# Altium project ProtoWatch.PrjPcb (part 2 of 2)

## Sheet LiPo_Charger.SchDoc: LiPo Charger
size 431 x 279 mm; VersionControl_RevNumber: 1.0; VersionControl_ProjFolderRevNumber: 1.0.0; ApprovedBy: ESE; CheckedBy: Justin, Bhagath; Author: Justin, bhagath; CompanyName: ESE Dept; DrawnBy: Justin, Bhagath; Engineer: Justin, Bhagath; Organization: ORGANIZATION; Address1: Electrical Engineering; Address2: 200 S 33rd St; Address3: Philadelphia; Address4: Pa 19104; DocumentNumber: 5; Revision: -; SheetNumber: 5; SheetTotal: 7; Project: ProtoWatch; ENG_APP_DATE: 02/12/21; DSN_APP_DATE: 02/12/21; CHK_APP_DATE: 02/12/21
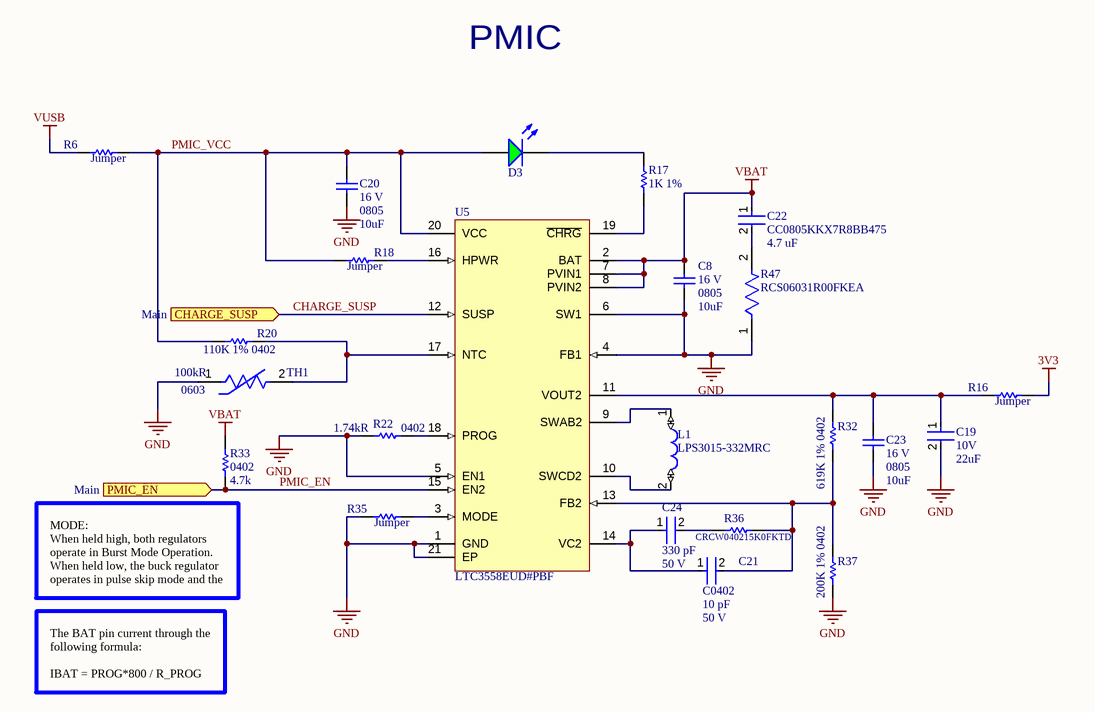
[diagram p4: LiPo_Charger.SchDoc]

### Parts
C8  value 10uF  Rated Voltage: 16 V  Case-EIA: 0805  [CAPC0805(2012)145_N]  (hidden comment: CAP 10uF 16V 0805(2012))
C19  Voltage Rating: 10V  Capacitance: 22uF  [FP-LMK107B-A-MFG]  (hidden comment: LMK107BBJ226MA-T)
C20  value 10uF  Rated Voltage: 16 V  Case-EIA: 0805  [CAPC0805(2012)145_N]  (hidden comment: CAP 10uF 16V 0805(2012))
C21  value 10 pF  Package: C0402  Voltage Rating: 50 V  [FP-C0402-BB-MFG]  (hidden comment: C0402C100D5GAC)
C22  CC0805KKX7R8BB475  Capacitance: 4.7 uF  [FP-CC0805-0_85-MFG]
C23  value 10uF  Rated Voltage: 16 V  Case-EIA: 0805  [CAPC0805(2012)145_N]  (hidden comment: CAP 10uF 16V 0805(2012))
C24  value 330 pF  Voltage Rating: 50 V  [FP-CC0402-MFG]  (hidden comment: CC0402KRX7R9BB331)
D3  LTST-C170GKT  [LTST-C170GKT_V]  (value not drawn)
L1  LPS3015-332MRC  [LPS3015]
R6  Jumper  [RESC0603(1608)_N]
R16  Jumper  [RESC0603(1608)_N]
R17  1K 1%  [RESC0603(1608)_N]
R18  Jumper  [RESC0603(1608)_N]
R20  110K 1% 0402  [RESC0402(1005)_M]
R22  Case/Package: 0402  Resistance: 1.74kR  [RESC1005X40X25LL05T05]  (hidden comment: CRCW04021K74FKED)
R32  619K 1% 0402  [RESC0402(1005)_L]
R33  Package Reference: 0402  Resistance (Ohms): 4.7k  [RESC1005X40X25LL10T15]  (hidden comment: RMCF0402JT4K70)
R35  Jumper  [RESC0603(1608)_N]
R36  CRCW040215K0FKTD  [RESC1005X40X25NL05T05]
R37  200K 1% 0402  [RESC0402(1005)_L]
R47  RCS06031R00FKEA  [FP-RCS0603-e3-MFG]
TH1  Case Code (Imperial): 0603  Resistance: 100kR  [FP-NCP18-0_15-MFG]  (hidden comment: NCP18WF104D03RB)
U5  LTC3558EUD#PBF  [LT-UD-20_N]

### Ports
CHARGE_SUSP (in, see Main), PMIC_EN (in, see Main)

### Nets
3V3: R16.2
GND: C8.1 C19.2 C20.1 C23.1 R22.1 R35.1 R37.2 R47.1 TH1.1 U5.1(GND) U5.4(FB1) U5.5(EN1) U5.6(SW1) U5.21(EP)
VBAT: C8.2 C22.1 R33.2 U5.2(BAT) U5.7(PVIN1) U5.8(PVIN2)
VUSB: R6.1
CHARGE_SUSP: U5.12(SUSP) ; port CHARGE_SUSP
PMIC_EN: R33.1 U5.15(EN2) ; port PMIC_EN
PMIC_VCC: C20.2 D3.1(A) R6.2 R18.1 R20.1 U5.20(VCC)  [project net PMIC_VCC_5]
NetC19_1: C19.1 C23.2 R16.1 R32.2 U5.11(VOUT2)
NetC21_1: C21.1 C24.1 U5.14(VC2)
NetC21_2: C21.2 R32.1 R36.2 R37.1 U5.13(FB2)
NetC22_2: C22.2 R47.2
NetC24_2: C24.2 R36.1
NetD3_2: D3.2(K) R17.1
NetL1_1: L1.1 U5.9(SWAB2)
NetL1_2: L1.2 U5.10(SWCD2)
NetR17_2: R17.2 U5.19(~{CHRG})
NetR18_2: R18.2 U5.16(HPWR)
NetR20_2: R20.2 TH1.2 U5.17(NTC)
NetR22_2: R22.2 U5.18(PROG)
NetR35_2: R35.2 U5.3(MODE)

### Notes on the sheet
- PMIC
- (near R33) MODE:
  When held high, both regulators operate in Burst Mode Operation. When held low, the buck regulator operates in pulse skip mode and the buck-boost regulator operates in PWM mode.
- The BAT pin current through the following formula:
  IBAT = PROG*800 / R_PROG
- DWG. NO.
- REV.
- SHT.
- THIS DOCUMENT AND THE DATA DISCLOSED HEREIN OR HEREWITH IS THE PROPERTY OF ALTIUM LIMITED AND MAY BE FREELY DISTRIBUTED IN WHOLE. NO RIGHTS ARE RESERVED OR EXPRESS OR IMPLIED WARANTEE GIVEN.
- REVISION
- DESCRIPTION
- DATE
- APPROVED
- ENG:
- APPROVALS
- PROJECT
- DSN:
- CHK:
- REFERENCE DOCUMENTS
- PROJECT REVISION:
- TITLE
- DOCUMENT REVISION:
- DESIGN ITEM:
- BOM:
- FAB DWG:
- PCB DWG:
- ASSY DWG:
- SCALE:
- SIZE
- B
- CAGE CODE
- FILE NAME
- DWG NO.
- SHEET
- OF
- REV

### Library data of the parts
C8 C20 C23 = CMP-1036-04927-1: CAP 10uF 16V ±10% 0805 (2012 Metric) Thickness 1.45mm SMD; Manufacturer Part Number: CC0805KKX7R7BB106; Tolerance: Â±10%; Case-Metric: 2012; Technology: SMT; Max Thickness: 1.45 mm; Manufacturer: *
C19 = CMP-14477-000010-1: CAP CER 22UF 10V X5R 0603; Manufacturer: Taiyo Yuden; Tolerance: 20%; Temperature Coefficient: 15%; Material: Ceramic; Category: Cap; Temperature: -55°C to +85°C; Ipc Land Pattern Name: CAPC16080X80; ComponentLink2Description: Datasheet; Automotive: No; Temperature Range High: +85°C; Temperature Range Low: -55°C; Device Class L2: Capacitors; Octopart: https://octopart.com/lmk107bbj226ma-t-taiyo+yuden-76689223; Lead Free: Yes; ComponentLink2URL: https://ds.yuden.co.jp/TYCOMPAS/eu/download?pn=LMK107BBJ226MA-T&fileType=CS; Device Class L3: Ceramic Capacitors; Manufacturer Part Number: LMK107BBJ226MA-T; Package: LMK107B-A; Digikey Description: CAP CER 22UF 10V X5R 0603; Device Class L1: Passive Components; Value: 22uF; RoHS: TRUE; Height: 1mm; Temperature Characteristic: X5R
C21 = CMP-1034-00720-3: C0402 10 pF C0G 0.5 pF 50 V; Manufacturer: Kemet; Tolerance: 0.5 pF; Material: Ceramic; Ipc Land Pattern Name: CAPC10050X50; Device Class L2: Capacitors; Temperature Range High: +125°C; Height: 0.55mm; Temperature Characteristic: C0G; Automotive: No; Device Class L1: Passive Components; ComponentLink2URL: https://content.kemet.com/datasheets/KEM_C1002_X7R_SMD.pdf; Octopart: https://octopart.com/c0402c100d5gac-kemet-2680337; Temperature: -55°C to +125°C; Category: Cap; ComponentLink2Description: Datasheet; Manufacturer Part Number: C0402C100D5GAC; Capacitance: 10 pF; Device Class L3: Ceramic Capacitors; Lead Free: Yes; Temperature Range Low: -55°C; Mouser Description: Cap Ceramic 10pF 50V C0G 0.5pF SMD 0402 125°C Bulk; RoHS: TRUE
C22 = CMP-03422-000306-1: CAP CER 4.7UF 25V X7R 0805; Manufacturer: Yageo; Material: Ceramic; Tolerance: 0.1; ComponentLink2Description: Datasheet; Footprint Url: http://www.yageo.com/exep/pages/download/literatures/UPY-C_GEN_24.pdf; Temperature Range High: +85°C; Package: CC0805-0.85; Octopart: https://octopart.com/cc0805kkx7r8bb475-yageo-51849247; Mouser Description: Multilayer Ceramic Capacitors MLCC - SMD/SMT 4.7M pF 10% 25 Volts; Ipc Land Pattern Name: CAPC200125X85; Temperature: -30°C to +85°C; Digikey Description: CAP CER 4.7UF 25V X7R 0805; Temperature Characteristic: X7R; Temperature Range Low: -30°C; Lead Free: Yes; RoHS: TRUE; Device Class L3: Ceramic Capacitors; ComponentLink2URL: http://www.yageo.com/documents/recent/UPY-GPHC_Y5V_6.3V-to-50V_8.pdf; Category: Cap; Value: 4.7 uF; Device Class L2: Capacitors; Manufacturer Part Number: CC0805KKX7R8BB475; Device Class L1: Passive Components; Height: 0.95mm; Automotive: No; Voltage Rating: 25 V
C24 = CMP-03422-001282-1: CAP CER 330PF 50V X7R 0402; Manufacturer: YAGEO; Automotive Grade: NA; Temperature Coefficient: 30ppm/°C; Material: Ceramic; Tolerance: 0.1; Mouser Description: Multilayer Ceramic Capacitors MLCC - SMD/SMT 330pF 50V X7R 10%; ComponentLink2Description: Datasheet; Temperature Characteristic: X7R; Temperature Range High: +125°C; Capacitance: 330 pF; ComponentLink2URL: http://www.yageo.com/documents/recent/UPY-GP_NP0_16V-to-50V_16.pdf; Manufacturer Part Number: CC0402KRX7R9BB331; Digikey Description: CAP CER 330PF 50V X7R 0402; Temperature Range Low: -55°C; Device Class L1: Passive Components; Package: CC0402; Height: 0.55mm; Temperature: -55°C to +125°C; Category: Cap; Octopart: https://octopart.com/cc0402krx7r9bb331-yageo-192880; Footprint Url: http://www.yageo.com/exep/pages/download/literatures/UPY-C_GEN_24.pdf; Device Class L2: Capacitors; Device Class L3: Ceramic Capacitors; Ipc Land Pattern Name: CAPC10050X50; Automotive: No; Lead Free: Yes; RoHS: TRUE
D3 = CMP-1674-00002-5: LED Uni-Color Green, 100 mW, 120 mA, -55 to 85 degC, 2-Pin SMD, RoHS, Tape and Reel; Manufacturer: Lite-On; PackageReference: C170GKT; ComponentLink1Description: Manufacturer URL; ComponentLink1URL: http://www.us.liteon.com/; Height: 1.1 mm; PackageDescription: 2-Pin Surface Mount Device, Body 2 x 1.25 mm; RoHSCompliant: true; Package Quantity: 1; Packaging: Tape and Reel; Mount: Surface Mount; Min Operating Temperature: -55 degC; DatasheetVersion: 03/2003; Max Operating Temperature: 85 degC; Pins: 2; Mounting Technology: Surface Mount; Length: 2 mm; Colour: Green; ComponentLink2URL: http://media.digikey.com/pdf/Data%20Sheets/Lite-On%20PDFs/LTST-C170GKT.pdf; ComponentLink2Description: Datasheet
L1 = LPS3015-332MRC: Power inductor, shielded, 20% tol, SMT, RoHS, lead-free, halogen-free; MF: Coilcraft; SnapEDA_Link: https://www.snapeda.com/parts/LPS3015-104MRB/Coilcraft/view-part/1499066/?ref=snap; MP: LPS3015-332MRC; Price: None; Availability: Unavailable; Value: *; Package: None
R6 R16 R18 R35 = CMP-1012-00001-1: Jumper 0603 (1608 Metric); Case-Metric: 1608; Value: 0.00 Ohm; Power: None; Case-EIA: 0603; Technology: SMT; Tolerance: None
R17 = CMP-1012-00510-1: 1K 0.1W 1% 0603 (1608 Metric)  SMD; Case-Metric: 1608; Case-EIA: 0603; Value: 1000.00 Ohm; Technology: SMT; Tolerance: 1 %; Power: 0.1 W
R20 = CMP-1011-00740-1: 110K 0.063W 1% 0402 (1005 Metric)  SMD; Case-EIA: 0402; Case-Metric: 1005; Value: 110000.00 Ohm; Technology: SMT; Tolerance: 1 %; Power: 0.063 W
R22 = CMP-2002-08306-1: Manufacturer: Vishay Dale; Tolerance: 1%; Temperature Coefficient: 100ppm/°C; Max Power Dissipation: 63mW; Voltage Rating: 50V; Part Number: CRCW04021K74FKED; Supplier 1: Digi-Key; Supplier Part Number 1: 541-1.74KLCT-ND; Manufacturer Part Number: CRCW04021K74FKED; RoHS: Yes; Category: Chip SMD Resistors; Stock 1: 1825; Pricing 1: 1=0.10000, 10=0.03300, 100=0.01330, 1000=0.00596, 2500=0.00518, 5000=0.00428 (USD); Number of Pins: 2; Contact Plating: Tin; Weight: 2.3E-05oz; Case Code (Metric): 1005; Case Code (Imperial): 0402; Size Code: 0402; Min Operating Temperature: -55°C; Max Operating Temperature: 155°C; Packaging: Tape and Reel; Package Quantity: 10; Resistor Type: Thick Film; Number of Terminations: 2; Features: Automotive AEC-Q200; Series: CRCW; Power Rating: 63mW; Termination: SMD/SMT; Voltage Rating (DC): 50V; Resistance Tolerance: 1%; Construction: Rectangular; Length: 1mm; Width: 0.02inch; Height: 0.016inch; Depth: 0.5mm; Radiation Hardening: No; Lead Free: Lead Free; RoHS Compliant: Yes; REACH SVHC: Unknown; Military Standard: Not; ComponentLink1URL: https://datasheet.ciiva.com/2464/dcrcwe3-2464006.pdf?src-supplier=Digi-Key; ComponentLink1Description: https://datasheet.ciiva.com/2464/dcrcwe3-2464006.pdf?src-supplier=Digi-Key; ComponentLink2URL: https://datasheet.ciiva.com/2464/dcrcwe3-2464008.pdf?src-supplier=Digi-Key; ComponentLink2Description: https://datasheet.ciiva.com/2464/dcrcwe3-2464008.pdf?src-supplier=Digi-Key; ComponentLink3URL: https://datasheet.ciiva.com/5552/dcrcwe3-109170-5552093.pdf?src-supplier=Mouser; ComponentLink3Description: https://datasheet.ciiva.com/5552/dcrcwe3-109170-5552093.pdf?src-supplier=Mouser; ComponentLink4URL: https://datasheet.ciiva.com/7670/1533075-7670358.pdf?src-supplier=Element14; ComponentLink4Description: https://datasheet.ciiva.com/7670/1533075-7670358.pdf?src-supplier=Element14; ComponentLink5URL: https://datasheet.ciiva.com/2464/dcrcwe3-2464007.pdf?src-supplier=Digi-Key; ComponentLink5Description: https://datasheet.ciiva.com/2464/dcrcwe3-2464007.pdf?src-supplier=Digi-Key; ComponentLink6URL: https://datasheet.ciiva.com/22870/70201119-22870760.pdf?src-supplier=Allied+Electronics; ComponentLink6Description: https://datasheet.ciiva.com/22870/70201119-22870760.pdf?src-supplier=Allied+Electronics
R32 = CMP-1011-00826-1: 619K 0.063W 1% 0402 (1005 Metric)  SMD; Case-Metric: 1005; Value: 619000.00 Ohm; Case-EIA: 0402; Power: 0.063 W; Tolerance: 1 %; Technology: SMT
R33 = CMP-2000-06988-1: Chip Resistor, 4.7 KOhm, +/- 5%, 0.063 W, -55 to 155 degC, 0402 (1005 Metric), RoHS, Tape and Reel; Manufacturer: Stackpole-Electronics-Inc.; Temperature Coefficient: ±100ppm/°C; Power (Watts): 0.063W,1/16W; Tolerance: ±5%; Family: ChipResistor-SurfaceMount; Datasheet Version: 01/2017; Composition: ThickFilm; Operating Temperature: -55°C~155°C; Features: AutomotiveAEC-Q200; Datasheet URL: https://www.seielect.com/Catalog/SEI-RMCF_RMCP.pdf; Package Description: 2-Pin Surface Mount Device, Body 1 x 0.5 mm; Packaging: Digi-Reel®; Package / Case: 0402(1005Metric); Category: Resistors; Mounting Technology: SurfaceMount; Number of Terminations: 2; Supplier Device Package: 0402; Manufacturer URL: https://www.seielect.com/; Series: RMCF
R36 = CMP-1011-00641-2: Manufacturer: Vishay Dale; Part Number: CRCW040215K0FKTD
R37 = CMP-1011-00768-1: 200K 0.063W 1% 0402 (1005 Metric)  SMD; Value: 200000.00 Ohm; Case-Metric: 1005; Case-EIA: 0402; Tolerance: 1 %; Power: 0.063 W; Technology: SMT
R47 = CMP-02407-008073-1: RES SMD 1 OHM 1% 1/4W 0603; Resistance: 1R; Temperature Coefficient: 100ppm/°C; Max Power Dissipation: 250mW; Height: 0.02inch; Case Code (Metric): 1608; Length: 0.061inch; Composition: Thick Film; Tolerance: 1%; Min Operating Temperature: -55°C; Width: 0.033inch; Case Code (Imperial): 0603; Case/Package: 0603; Features: Automotive AEC-Q200; Max Operating Temperature: 155°C; Number of Terminations: 2; Packaging: Tape and Reel
TH1 = CMP-06022-000395-2: NTC Thermistor for Temperature Sensor, 0603, 100kΩ, 0.5%, 0.032mA, 5V; Max Power Dissipation: 100mW; Case Code (Metric): 1608; Length: 1.6mm; Termination: SMD/SMT; Case/Package: 0603; Tolerance: 0.5%; Width: 0.8mm; Packaging: Tape and Reel; Power Rating: 100mW; Package Quantity: 1; Number of Pins: 2; Height: 0.8mm; Min Operating Temperature: -40°C; Max Operating Temperature: 125°C; Mount: Surface Mount; Depth: 0.8mm
U5 = LTC3558EUD#PBF: Linear USB Battery Charger with Buck and Buck-Boost Regulator, 4.3 to 5.5 V Vin, 20-pin QFN (UD-20), -40 to 85 degC, Pb-Free; Manufacturer: Linear Technology; Number of Cells: 1; Vin Max(V): 5.5; Vin Min(V): 4.3; Number of Outputs: 2; Mounting Technology: Surface Mount; PartNumber: LTC3558EUD#PBF; PackageReference: UD-20; ComponentLink3URL: http://cds.linear.com/docs/en/packaging/QFN_20_05-08-1720.pdf; ComponentLink2Description: Datasheet; ComponentLink1URL: http://www.linear.com/; RoHS: TRUE; ComponentLink3Description: Package Specification; ComponentLink1Description: Manufacturer URL; PackageDescription: 20-Pin Plastic QFN, Body 3 x 3 mm, Pitch 0.4 mm; ComponentLink2URL: http://cds.linear.com/docs/en/datasheet/3558.pdf; PackageVersion: Rev. A, 06/2010

## Sheet Sensors.SchDoc: Sensors
size 431 x 279 mm; VersionControl_RevNumber: 1.0; VersionControl_ProjFolderRevNumber: 1.0.0; ApprovedBy: ESE; CheckedBy: Justin, Bhagath; Author: Justin, bhagath; CompanyName: ESE Dept; DrawnBy: Justin, Bhagath; Engineer: Justin, Bhagath; Organization: ORGANIZATION; Address1: Electrical Engineering; Address2: 200 S 33rd St; Address3: Philadelphia; Address4: Pa 19104; DocumentNumber: 6; Revision: -; SheetNumber: 6; SheetTotal: 7; Project: ProtoWatch; ENG_APP_DATE: 02/12/21; DSN_APP_DATE: 02/12/21; CHK_APP_DATE: 02/12/21
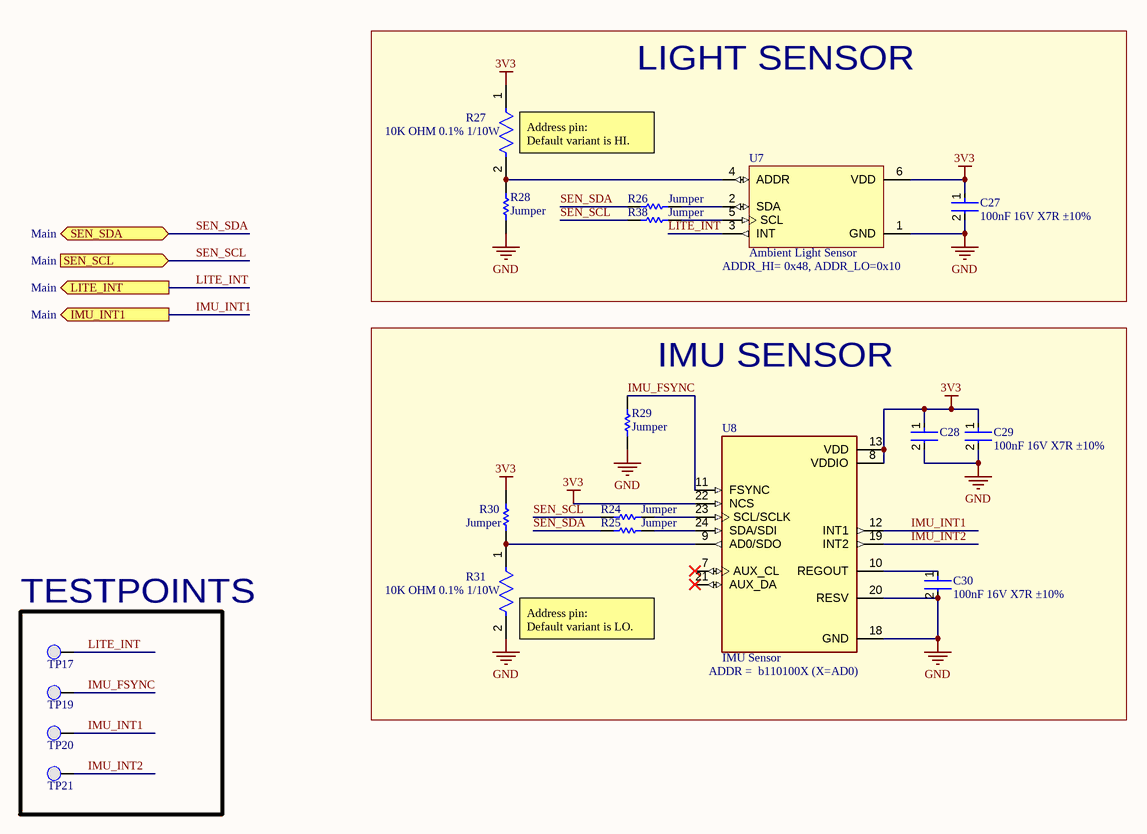
[diagram p5: Sensors.SchDoc]

### Parts
C27  100nF 16V X7R ±10%  [FP-CL10-IPC_A]
C28  100nF 16V X7R ±10%  [FP-CL10-IPC_A]  (value not drawn)
C29  100nF 16V X7R ±10%  [FP-CL10-IPC_A]
C30  100nF 16V X7R ±10%  [FP-CL10-IPC_A]
R24  Jumper  [RESC0603(1608)_N]
R25  Jumper  [RESC0603(1608)_N]
R26  Jumper  [RESC0603(1608)_N]
R27  10K OHM 0.1% 1/10W  [FP-RT0603-MFG]
R28  Jumper  [RESC0603(1608)_N]
R29  Jumper  [RESC0603(1608)_N]
R30  Jumper  [RESC0603(1608)_N]
R31  10K OHM 0.1% 1/10W  [FP-RT0603-MFG]
R38  Jumper  [RESC0603(1608)_N]
TP17  0.1" Pad  [PCBComponent]  (value not drawn)  (no BOM)
TP19  0.1" Pad  [PCBComponent]  (value not drawn)  (no BOM)
TP20  0.1" Pad  [PCBComponent]  (value not drawn)  (no BOM)
TP21  0.1" Pad  [PCBComponent]  (value not drawn)  (no BOM)
U7  Ambient Light Sensor  [VISHAY_VEML6030_2X2X0.87]
U8  IMU Sensor  [ICM-20649]

### Blocks framed on the sheet
LIGHT SENSOR: C27 R26-R28 R38 U7
IMU SENSOR: C28-C30 R24 R25 R29-R31 U8
TESTPOINTS: TP17 TP19-TP21

### Ports
IMU_INT1 (out, see Main), LITE_INT (out, see Main), SEN_SCL (in, see Main), SEN_SDA (bidir, see Main)

### Nets
3V3: C27.1 C28.1 C29.1 R27.1 R30.2 U7.6(VDD) U8.8(VDDIO) U8.13(VDD) U8.22(NCS)
GND: C27.2 C28.2 C29.2 C30.2 R28.1 R29.1 R31.2 U7.1(GND) U8.18(GND) U8.20(RESV)
IMU_FSYNC: R29.2 TP19.1(PAD) U8.11(FSYNC)  [project net IMU_FSYNC_6]
IMU_INT1: TP20.1(PAD) U8.12(INT1) ; port IMU_INT1
IMU_INT2: TP21.1(PAD) U8.19(INT2)  [project net IMU_INT2_6]
LITE_INT: TP17.1(PAD) U7.3(INT) ; port LITE_INT
SEN_SCL: R24.2 R38.2 ; port SEN_SCL
SEN_SDA: R25.2 R26.2 ; port SEN_SDA
NetC30_1: C30.1 U8.10(REGOUT)
NetR24_1: R24.1 U8.23(SCL/SCLK)
NetR25_1: R25.1 U8.24(SDA/SDI)
NetR26_1: R26.1 U7.2(SDA)
NetR27_2: R27.2 R28.2 U7.4(ADDR)
NetR30_1: R30.1 R31.1 U8.9(AD0/SDO)
NetR38_1: R38.1 U7.5(SCL)

Not connected (* = marked no-connect by the designer): U8 7(AUX_CL)* 21(AUX_DA)*

### Notes on the sheet
- (near R27) Address pin:
  Default variant is HI.
- (near U7) ADDR_HI= 0x48, ADDR_LO=0x10
- (near R31) Address pin:
  Default variant is LO.
- (near U8) ADDR =  b110100X (X=AD0)
- DWG. NO.
- REV.
- SHT.
- THIS DOCUMENT AND THE DATA DISCLOSED HEREIN OR HEREWITH IS THE PROPERTY OF ALTIUM LIMITED AND MAY BE FREELY DISTRIBUTED IN WHOLE. NO RIGHTS ARE RESERVED OR EXPRESS OR IMPLIED WARANTEE GIVEN.
- REVISION
- DESCRIPTION
- DATE
- APPROVED
- ENG:
- APPROVALS
- PROJECT
- DSN:
- CHK:
- REFERENCE DOCUMENTS
- PROJECT REVISION:
- TITLE
- DOCUMENT REVISION:
- DESIGN ITEM:
- BOM:
- FAB DWG:
- PCB DWG:
- ASSY DWG:
- SCALE:
- SIZE
- B
- CAGE CODE
- FILE NAME
- DWG NO.
- SHEET
- OF
- REV

### Library data of the parts
C27-C30 = CMP-13271-002478-1: Cap Ceramic 100nF 16V X7R ±10% Pad SMD 0603 +125°C T/R CL10B104KO8NNNL; Width: 0.031inch; Case/Package: 0603; Depth: 0.8mm; Packaging: Tape and Reel; Min Operating Temperature: -55°C; Thickness: 0.035inch; Voltage Rating: 16V; Radiation Hardening: No; Package Quantity: 15000; Voltage Rating (DC): 16V; Max Operating Temperature: 125°C; Voltage: 16V; Tolerance: 10%; Dielectric: X7R; Capacitance: 100nF; Lead Free: Lead Free; Height: 0.8mm; Mount: Surface Mount; Length: 1.6mm
R24-R26 R28-R30 R38 = CMP-1012-00001-1: as R6 on sheet LiPo_Charger; Technology: SMT; Tolerance: None
R27 R31 = CMP-2000-04341-2: RES SMD 10K OHM 0.1% 1/10W 0603 RT0603BRB0710KL; Manufacturer: Yageo; Temperature Coefficient: 10 ppm/°C; Tolerance: 0.001; Value: 10KΩ; Power Rating: 0.1W; Voltage Rating: 75V; Lead Free: Yes; ComponentLink2URL: http://www.yageo.com/documents/recent/PYu-RT_1-to-0.01_RoHS_L_9.pdf; Temperature: -55°C to +155°C; Device Class L1: Passive Components; Device Class L3: Chip SMD Resistors; Footprint Url: http://www.yageo.com/exep/pages/download/literatures/PYu-R_Mount_10.pdf; Mouser Description: Thin Film Resistors - SMD 1/10W 10K ohm .1% 10ppm; Ipc Land Pattern Name: RESC16080X45; Device Class L2: Resistors; Manufacturer Part Number: RT0603BRB0710KL; Series: RT; Composition: Thin Film; Temperature Range High: +155°C; RoHS: TRUE; Temperature Range Low: -55°C; Package: RT0603; Octopart: https://octopart.com/rt0603brb0710kl-yageo-22252377; Automotive: No; Height: 0.55mm; Digikey Description: RES SMD 10K OHM 0.1% 1/10W 0603; Category: Res; ComponentLink2Description: Datasheet; Resistance: 10KΩ
TP17 TP19-TP21 = 0.1" Pad-A.4
U7 = VEML6030: Optical Sensor Ambient 550nm IÂ²C 6-SMD, No Lead; MF: Vishay; Value: *; Price: None; Package: SMD-6 Vishay; SnapEDA_Link: https://www.snapeda.com/parts/VEML6030/Vishay%20Semiconductor%20Opto%20Division/view-part/493148/?ref=snap; Availability: Unavailable; MP: VEML6030; Manufacturer Part Number 1: VEML6030
U8 = ICM-20649: Accelerometer, Gyroscope, Temperature, 6 Axis Sensor IÂ²C, SPI Output; MF: TDK InvenSense; Package: QFN-24 InvenSense; Price: None; Availability: Unavailable; MP: ICM-20649; SnapEDA_Link: https://www.snapeda.com/parts/ICM-20649/TDK%20InvenSense/view-part/557276/?ref=snap; Value: *; Manufacturer Part Number 1: ICM-20649

## Sheet Nav_Buttons.SchDoc: Nav Buttons
size 431 x 279 mm; VersionControl_RevNumber: 1.0; VersionControl_ProjFolderRevNumber: 1.0.0; ApprovedBy: ESE; CheckedBy: Justin, Bhagath; Author: Justin, bhagath; CompanyName: ESE Dept; DrawnBy: Justin, Bhagath; Engineer: Justin, Bhagath; Organization: ORGANIZATION; Address1: Electrical Engineering; Address2: 200 S 33rd St; Address3: Philadelphia; Address4: Pa 19104; DocumentNumber: 7; Revision: -; SheetNumber: 7; SheetTotal: 7; Project: ProtoWatch; ENG_APP_DATE: 02/12/21; DSN_APP_DATE: 02/12/21; CHK_APP_DATE: 02/12/21
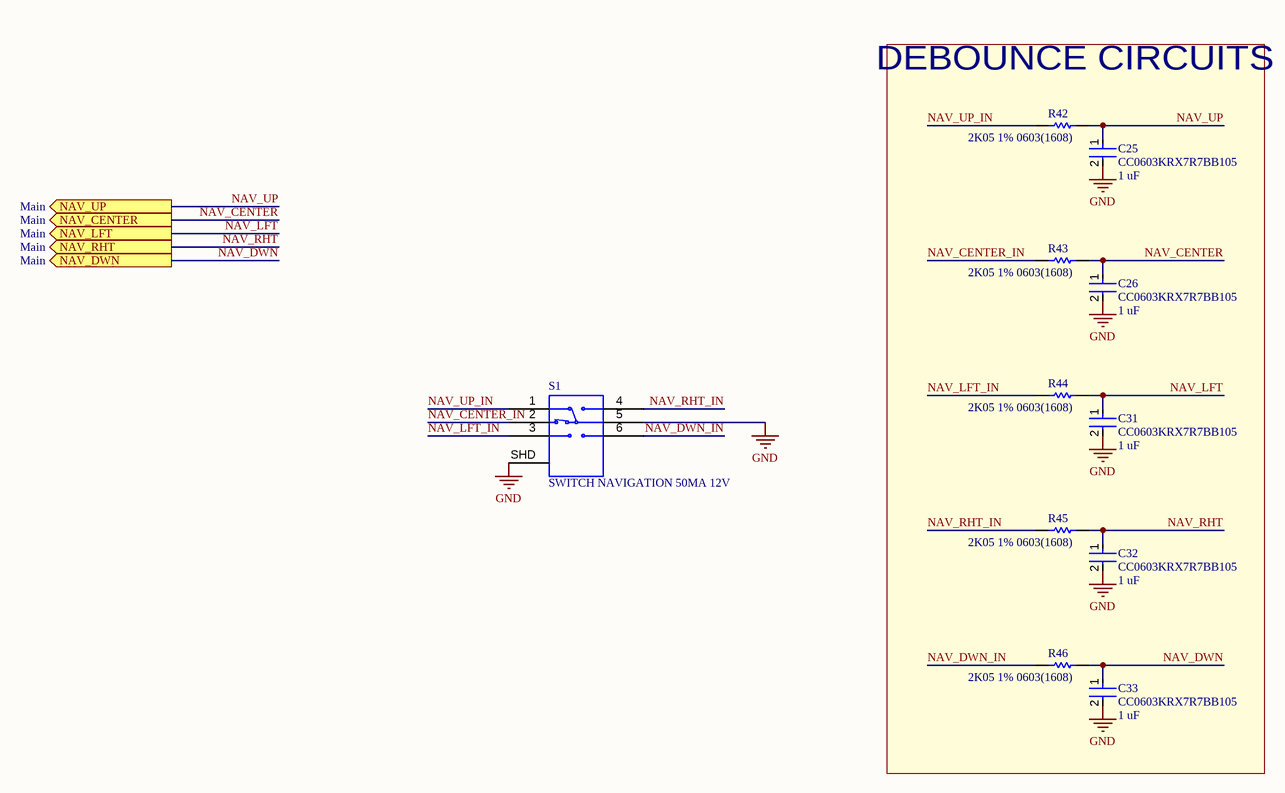
[diagram p6: Nav_Buttons.SchDoc]

### Parts
C25  CC0603KRX7R7BB105  value 1 uF  [FP-CC0603-DA-MFG]
C26  CC0603KRX7R7BB105  value 1 uF  [FP-CC0603-DA-MFG]
C31  CC0603KRX7R7BB105  value 1 uF  [FP-CC0603-DA-MFG]
C32  CC0603KRX7R7BB105  value 1 uF  [FP-CC0603-DA-MFG]
C33  CC0603KRX7R7BB105  value 1 uF  [FP-CC0603-DA-MFG]
R42  2K05 1% 0603(1608)  [RESC0603(1608)_L]
R43  2K05 1% 0603(1608)  [RESC0603(1608)_L]
R44  2K05 1% 0603(1608)  [RESC0603(1608)_L]
R45  2K05 1% 0603(1608)  [RESC0603(1608)_L]
R46  2K05 1% 0603(1608)  [RESC0603(1608)_L]
S1  SWITCH NAVIGATION 50MA 12V  [SW_JS1400AFQ]

### Blocks framed on the sheet
DEBOUNCE CIRCUITS: C25 C26 C31-C33 R42-R46

### Ports
NAV_CENTER (out, see Main), NAV_DWN (out, see Main), NAV_LFT (out, see Main), NAV_RHT (out, see Main), NAV_UP (out, see Main)

### Nets
GND: C25.2 C26.2 C31.2 C32.2 C33.2 S1.5 S1.SHD(SHIELD)
NAV_CENTER: C26.1 R43.2 ; port NAV_CENTER
NAV_CENTER_IN: R43.1 S1.2  [project net NAV_CENTER_IN_7]
NAV_DWN: C33.1 R46.2 ; port NAV_DWN
NAV_DWN_IN: R46.1 S1.6  [project net NAV_DWN_IN_7]
NAV_LFT: C31.1 R44.2 ; port NAV_LFT
NAV_LFT_IN: R44.1 S1.3  [project net NAV_LFT_IN_7]
NAV_RHT: C32.1 R45.2 ; port NAV_RHT
NAV_RHT_IN: R45.1 S1.4  [project net NAV_RHT_IN_7]
NAV_UP: C25.1 R42.2 ; port NAV_UP
NAV_UP_IN: R42.1 S1.1  [project net NAV_UP_IN_7]

### Notes on the sheet
- DWG. NO.
- REV.
- SHT.
- THIS DOCUMENT AND THE DATA DISCLOSED HEREIN OR HEREWITH IS THE PROPERTY OF ALTIUM LIMITED AND MAY BE FREELY DISTRIBUTED IN WHOLE. NO RIGHTS ARE RESERVED OR EXPRESS OR IMPLIED WARANTEE GIVEN.
- REVISION
- DESCRIPTION
- DATE
- APPROVED
- ENG:
- APPROVALS
- PROJECT
- DSN:
- CHK:
- REFERENCE DOCUMENTS
- PROJECT REVISION:
- TITLE
- DOCUMENT REVISION:
- DESIGN ITEM:
- BOM:
- FAB DWG:
- PCB DWG:
- ASSY DWG:
- SCALE:
- SIZE
- B
- CAGE CODE
- FILE NAME
- DWG NO.
- SHEET
- OF
- REV

### Library data of the parts
C25 C26 C31-C33 = CMP-03422-000924-1: CAP CER 1UF 16V X7R 0603; Manufacturer: YAGEO; Tolerance: 0.1; Temperature Coefficient: 15%; Material: Ceramic; Package: CC0603-DA; RoHS: TRUE; Device Class L2: Capacitors; Temperature Characteristic: X7R; Temperature: -55°C to +125°C; Temperature Range Low: -55°C; Automotive: No; ComponentLink2Description: Datasheet; Lead Free: Yes; Capacitance: 1 uF; ComponentLink2URL: http://www.yageo.com/documents/recent/UPY-GPHC_X7R_6.3V-to-50V_18.pdf; Device Class L1: Passive Components; Voltage: 16 V; Octopart: https://octopart.com/cc0603krx7r7bb105-yageo-42271928; Category: Cap; Digikey Description: CAP CER 1UF 16V X7R 0603; Footprint Url: http://www.yageo.com/exep/pages/download/literatures/UPY-C_GEN_24.pdf; Height: 0.9mm; Manufacturer Part Number: CC0603KRX7R7BB105; Voltage Rating: 16 V; Temperature Range High: +125°C; Mouser Description: Multilayer Ceramic Capacitor, CC Series, 1 - F, - 10%, X7R, 16 V, 0603 [1608 Metric]; Device Class L3: Ceramic Capacitors
R42-R46 = CMP-1012-00543-1: 2K05 0.1W 1% 0603 (1608 Metric)  SMD; Value: 2050.00 Ohm; Case-Metric: 1608; Case-EIA: 0603; Tolerance: 1 %; Technology: SMT; Power: 0.1 W
S1 = JS1400AFQ: Navigation Switch, 2 - Axis Digital (Mechanical Switch) Output; MF: E-Switch; Digi-Key_Part_Number: EG5857-ND; MP: JS1400AFQ; Value: *; Package: None; manufacturer Part Number 1: JS1400AFQ

## Nets that join several sheets
3V3: MAIN (6 pins), MCU (7 pins), Memory (5 pins), LiPo_Charger (R16.2), Sensors (9 pins)
GND: MAIN (10 pins), FTDI (10 pins), MCU (19 pins), Memory (5 pins), LiPo_Charger (14 pins), Sensors (10 pins), Nav_Buttons (7 pins)
VBAT: MAIN (R19.1 TP22.1), LiPo_Charger (6 pins)
VBUS: MAIN (J1.1), FTDI (C2.1 D1.4 FB1.1)
VUSB: MAIN (TP1.1), FTDI (6 pins), LiPo_Charger (R6.1)
CHARGE_SUSP: MCU (U4.45), LiPo_Charger (U5.12)
FLASH_MEM_SPI_SS: MCU (U4.37), Memory (R13.1 SD1.2 TP11.1)
IMU_INT1: MCU (U4.9), Sensors (TP20.1 U8.12)
LCD_LITE: MAIN (J2.1), MCU (U4.40)
LITE_INT: MCU (U4.34), Sensors (TP17.1 U7.3)
MCU_LED: MAIN (DS1.2), MCU (U4.16)
MCU_RX_UART_CLI: MAIN (TP4.1), FTDI (U1.7), MCU (U4.44)
MCU_TX_UART_CLI: MAIN (TP2.1), FTDI (U1.10), MCU (U4.43)
MEM_SPI_CLK: MAIN (R10.2), Memory (SD1.5 TP10.1)
MEM_SPI_MISO: MAIN (R9.2), Memory (SD1.7 TP9.1)
MEM_SPI_MOSI: MAIN (R8.2), Memory (SD1.3 TP8.1)
NAV_CENTER: MCU (U4.19), Nav_Buttons (C26.1 R43.2)
NAV_DWN: MCU (U4.36), Nav_Buttons (C33.1 R46.2)
NAV_LFT: MCU (U4.18), Nav_Buttons (C31.1 R44.2)
NAV_RHT: MCU (U4.35), Nav_Buttons (C32.1 R45.2)
NAV_UP: MCU (U4.22), Nav_Buttons (C25.1 R42.2)
PMIC_EN: MCU (U4.46), LiPo_Charger (R33.1 U5.15)
SD1_CS: MAIN (J2.6), MCU (U4.41)
SEN_SCL: MAIN (P2.1 R21.1), MCU (U4.38), Sensors (R24.2 R38.2)
SEN_SDA: MAIN (P2.2 R23.1), MCU (U4.39), Sensors (R25.2 R26.2)
SERCOM1_PAD2_SPI_MISO: MAIN (R9.1), MCU (U4.8)
SERCOM1_PAD2_SPI_MOSI: MAIN (R8.1), MCU (U4.11)
SERCOM1_PAD3_SPI_SCK: MAIN (R10.1), MCU (U4.12)
STATUS_LED: MAIN (D2.2), MCU (U4.27)
TFT_CS: MAIN (J2.5), MCU (U4.31)
TFT_DC: MAIN (J2.7), MCU (U4.33)
TFT_MISO: MAIN (R39.1), MCU (U4.13)
TFT_MOSI: MAIN (R41.1), MCU (U4.15)
TFT_RST: MAIN (J2.8), MCU (U4.14)
TFT_SCK: MAIN (R40.1), MCU (U4.28)
USB_DATA_N: MAIN (J1.2), FTDI (C5.2 D1.3 R1.1)
USB_DATA_P: MAIN (J1.3), FTDI (C6.2 D1.2 R2.1)

## Assembly variants
Build_Alt: not fitted FD1 FD2 FD3 P? R28 R30 TP1 TP2 TP3 TP4 TP5 TP5 TP6 TP7 TP8 TP9 TP10 TP11 TP12 TP13 TP14 TP15 TP16 TP17 TP18 TP19 TP20 TP21 TP22 TP23